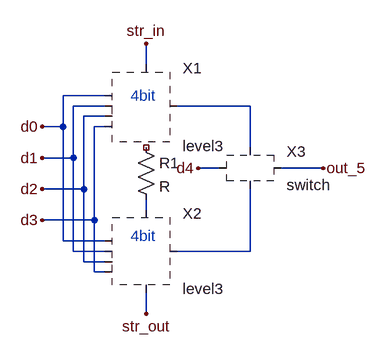
[diagram p0: schematic level4.asc]
level4.asc, the LTspice schematic file:
Version 4
SHEET 1 880 680
WIRE 128 16 128 -16
WIRE 64 64 0 64
WIRE 64 80 16 80
WIRE 288 80 176 80
WIRE 64 96 32 96
WIRE 0 112 0 64
WIRE 0 112 -32 112
WIRE 64 112 48 112
WIRE 288 144 288 80
WIRE 16 160 16 80
WIRE 16 160 -32 160
WIRE 240 176 208 176
WIRE 400 176 336 176
WIRE 32 208 32 96
WIRE 32 208 -32 208
WIRE 128 240 128 224
WIRE 48 256 48 112
WIRE 48 256 -32 256
WIRE 0 288 0 112
WIRE 64 288 0 288
WIRE 16 304 16 160
WIRE 64 304 16 304
WIRE 288 304 288 208
WIRE 288 304 176 304
WIRE 32 320 32 208
WIRE 64 320 32 320
WIRE 48 336 48 256
WIRE 64 336 48 336
WIRE 128 400 128 368
FLAG -32 112 d0
FLAG -32 160 d1
FLAG -32 208 d2
FLAG -32 256 d3
FLAG 208 176 d4
FLAG 400 176 out_5
FLAG 128 400 str_out
FLAG 128 -16 str_in
SYMBOL level3 128 80 R0
SYMATTR InstName X1
SYMBOL level3 128 304 R0
SYMATTR InstName X2
SYMBOL switch 288 176 R0
SYMATTR InstName X3
SYMBOL res 112 128 R0
SYMATTR InstName R1
TEXT 104 64 Left 2 ;4bit
TEXT 104 280 Left 2 ;4bit

The netlist it stands for:
* level4.asc
* X1: level3 (symbol level3 not available, pin order unknown); nets seen at it: d0, d1, d2, d3, N001, str_in
* X2: level3 (symbol level3 not available, pin order unknown); nets seen at it: d0, d1, d2, d3, N002, N003, str_out
* X3: switch (symbol switch not available, pin order unknown); nets seen at it: d4, N001, N003, out_5
R1 NC_01 N002 R
* 4bit
* 4bit
.backanno
.end